# Altium schematic sheet sigmaDeltaComplete.SchDoc
size A4
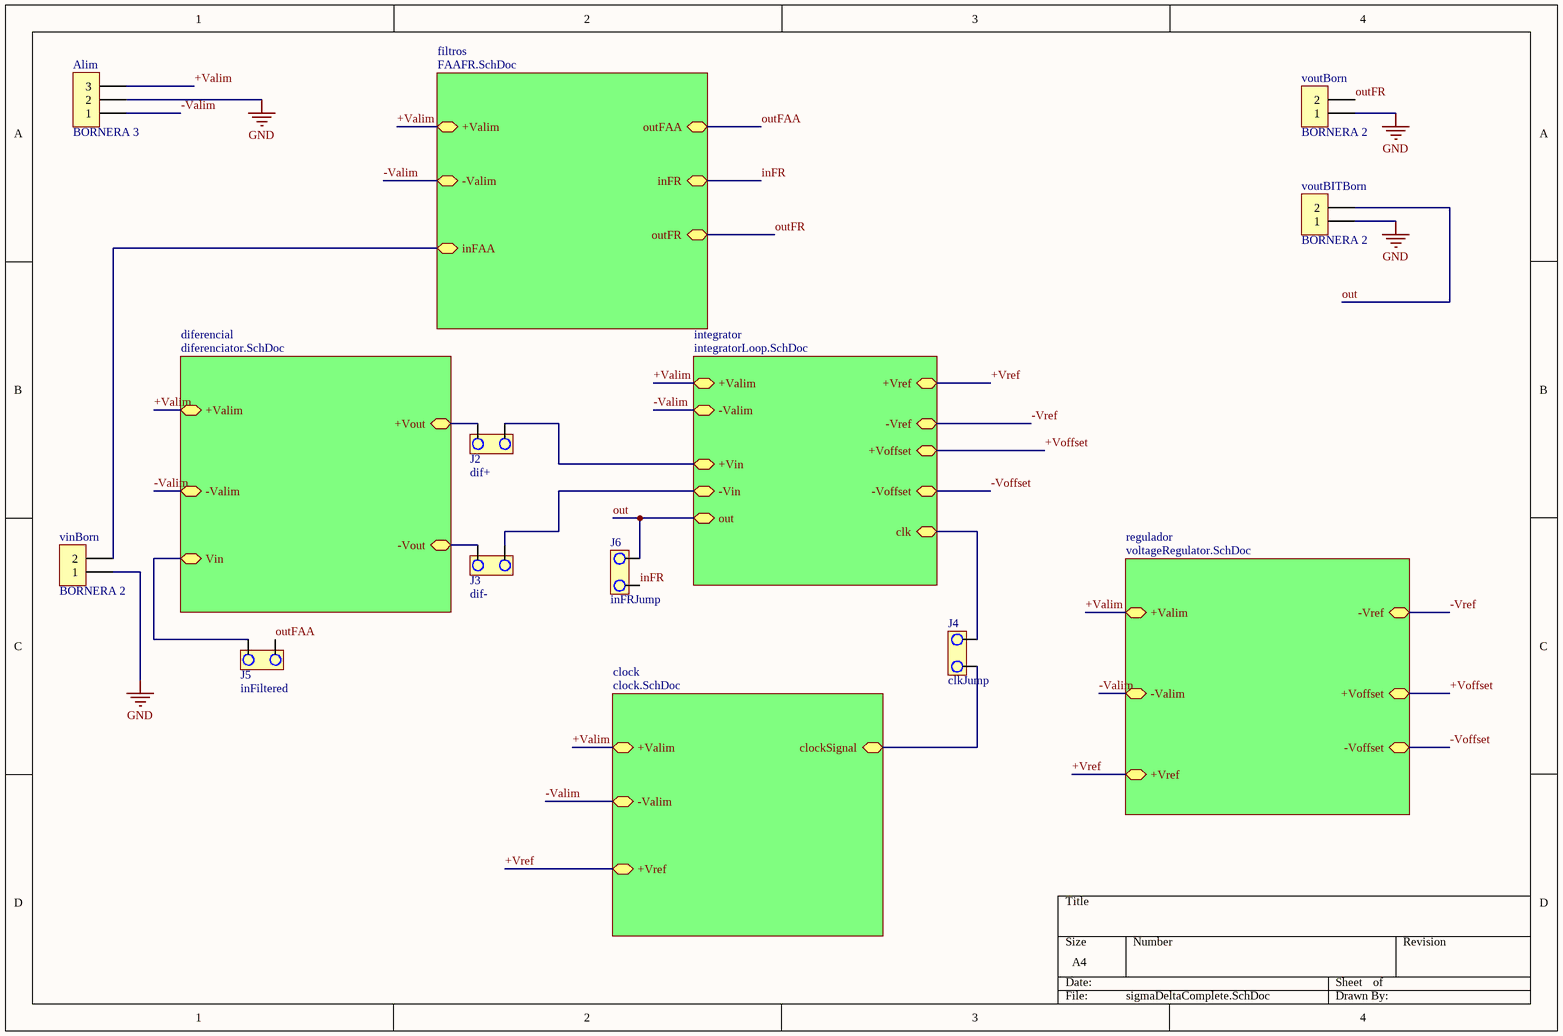
[diagram p0: sigmaDeltaComplete.SchDoc]

## Parts
Alim  BORNERA 3  [BORNERA3]
J2  dif+  [JUMPER2]
J3  dif-  [JUMPER2]
J4  clkJump  [JUMPER2]
J5  inFiltered  [JUMPER2]
J6  inFRJump  [JUMPER2]
vinBorn  BORNERA 2  [BORNERA2]
voutBITBorn  BORNERA 2  [BORNERA2]
voutBorn  BORNERA 2  [BORNERA2]

## Sub-sheets
clock = clock.SchDoc: +Valim, -Valim, +Vref, clockSignal
diferencial = diferenciator.SchDoc: +Valim, -Valim, Vin, +Vout, -Vout
filtros = FAAFR.SchDoc: +Valim, -Valim, inFAA, outFAA, inFR, outFR
integrator = integratorLoop.SchDoc: +Valim, -Valim, +Vin, -Vin, out, +Vref, -Vref, +Voffset, -Voffset, clk
regulador = voltageRegulator.SchDoc: +Valim, -Valim, +Vref, -Vref, +Voffset, -Voffset

## Nets
GND: Alim.2 vinBorn.1 voutBITBorn.1 voutBorn.1
+Valim: Alim.3 ; sheet integrator/+Valim, sheet clock/+Valim, sheet diferencial/+Valim, sheet regulador/+Valim, sheet filtros/+Valim
+Voffset: sheet integrator/+Voffset, sheet regulador/+Voffset
+Vref: sheet integrator/+Vref, sheet clock/+Vref, sheet regulador/+Vref
-Valim: Alim.1 ; sheet integrator/-Valim, sheet clock/-Valim, sheet diferencial/-Valim, sheet regulador/-Valim, sheet filtros/-Valim
-Voffset: sheet integrator/-Voffset, sheet regulador/-Voffset
-Vref: sheet integrator/-Vref, sheet regulador/-Vref
inFR: J6.2 ; sheet filtros/inFR
out: J6.1 voutBITBorn.2 ; sheet integrator/out
outFAA: J5.2 ; sheet filtros/outFAA
outFR: voutBorn.2 ; sheet filtros/outFR
NetJ2_1: J2.1 ; sheet diferencial/+Vout
NetJ2_2: J2.2 ; sheet integrator/+Vin
NetJ3_1: J3.1 ; sheet diferencial/-Vout
NetJ3_2: J3.2 ; sheet integrator/-Vin
NetJ4_1: J4.1 ; sheet integrator/clk
NetJ4_2: J4.2 ; sheet clock/clockSignal
NetJ5_1: J5.1 ; sheet diferencial/Vin
NetvinBorn_2: vinBorn.2 ; sheet filtros/inFAA

## Library data of the parts
J2-J6 = JUMPER